# EAGLE schematic Vertrangingsschema schema (EAGLE 9.2.2)
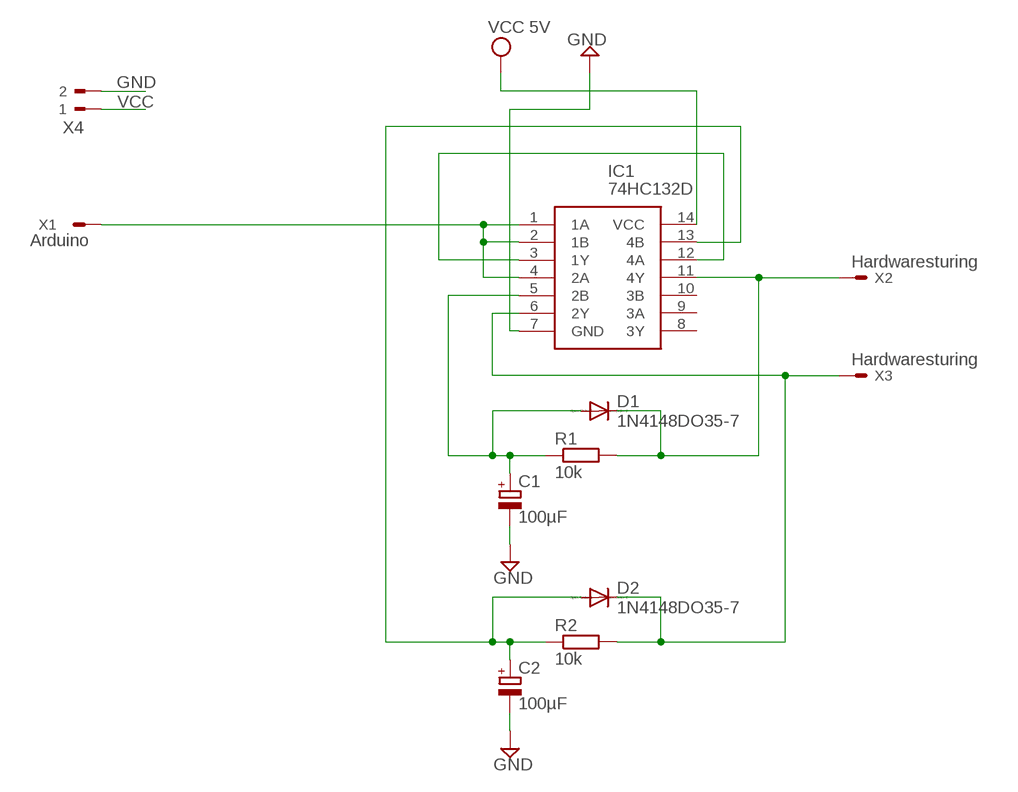
[diagram p0: schematic, sheet 1]

## Parts
C1  100µF  ELCO  [E3,5-8]
C2  100µF  ELCO  [E3,5-8]
D1  1N4148DO35-7  [DO35-7]
D2  1N4148DO35-7  [DO35-7]
IC1  74HC132D  [SOIC127P600X175-14N]
R1  10k  RESISTOR  [RDH/15]
R2  10k  RESISTOR  [RDH/15]
X1  Arduino  332-02  [332-02]
X2  Hardwaresturing  332-02  [332-02]
X3  Hardwaresturing  332-02  [332-02]
X4  90-2  [90-2]

## Nets
GND: C1.- C2.- IC1.7(GND) X4.2
N$1: IC1.1(1A) IC1.2(1B) IC1.4(2A) X1.1(S)
N$2: IC1.3(1Y) IC1.12(4A)
N$3: C1.+ D1.A IC1.5(2B) R1.1
N$5: D1.C IC1.11(4Y) R1.2 X2.1(S)
N$6: D2.C IC1.6(2Y) R2.2 X3.1(S)
N$7: C2.+ D2.A IC1.13(4B) R2.1
VCC: IC1.14(VCC) X4.1 ; supply symbol labelled VCC 5V
Unconnected: IC1.8(3Y) IC1.9(3A) IC1.10(3B)

## Library data of the parts
C1 C2 = Vertrangingsschema library:ELCO
D1 D2 = Vertrangingsschema library:1N4148: DIODE high speed (Philips)
IC1 = Vertrangingsschema library:74HC132D: 74HC132D, Logic Gate Quad 2 Input NAND, HC, 5.2mA 2 to 6V 14-Pin SOIC Source: Datasheet <http://www.nxp.com/documents/data_sheet/74HC_HCT132.pdf>; ARROW_PART_NUMBER: 74HC132D; ARROW_PRICE-STOCK: http://uk.rs-online.com/web/p/products/4367408; DESCRIPTION: 74HC132D, Logic Gate Quad 2 Input NAND, HC, 5.2mA 2 to 6V 14-Pin SOIC; HEIGHT: 1.75mm; MANUFACTURER_NAME: Nexperia; MANUFACTURER_PART_NUMBER: 74HC132D; RS_PART_NUMBER: 4367408; RS_PRICE-STOCK: http://uk.rs-online.com/web/p/products/4367408
R1 R2 = Vertrangingsschema library:RESISTOR
X1-X3 = Vertrangingsschema library:332-02: 2 Pin - 2mm Dual Row Source: www.mpe-connector.de / garry_shortform_2012.pdf
X4 = Vertrangingsschema library:90-2: WEIDMUELLER CLAMP CONNECTOR; OC_FARNELL: unknown; OC_NEWARK: unknown